# Altium schematic sheet Arduino.SchDoc
size A3; SheetNumber: 3; SheetTotal: 5
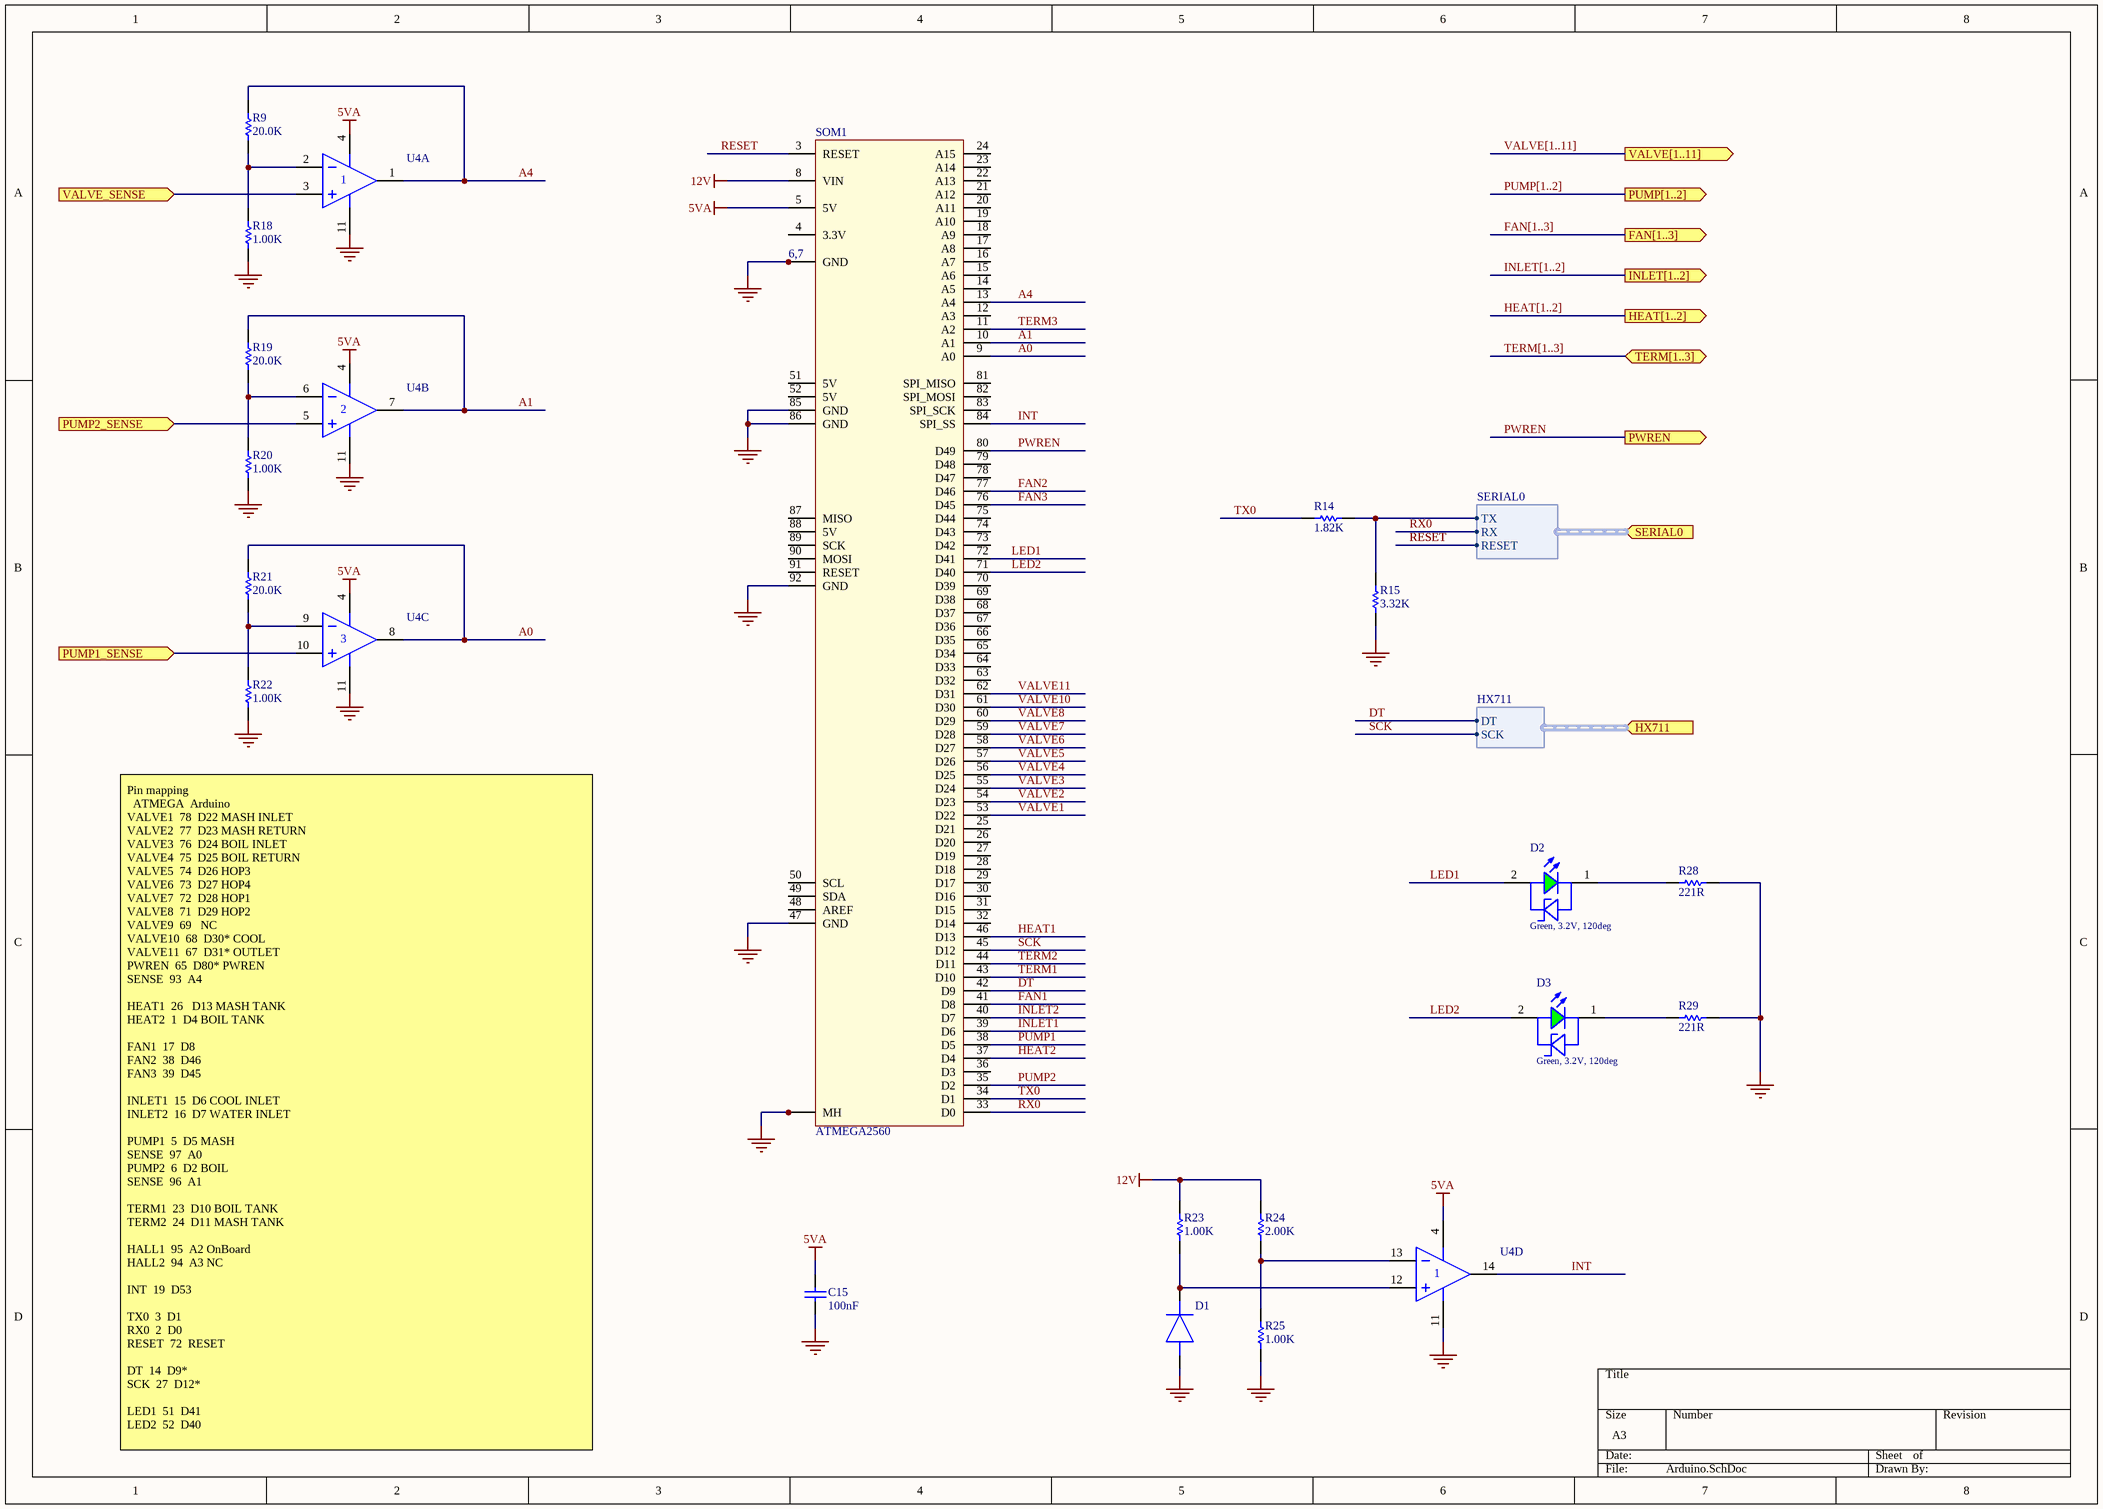
[diagram p0: Arduino.SchDoc]

## Parts
C15  value 100nF  [CAP_0603_H090 (_IPC_MD)]  (hidden comment: 100nF 0603)
D1  LL4148-GS18  [SOD-80]  (value not drawn)
D2  Green, 3.2V, 120deg  [WL-SMCC_0603_GS_BS]
D3  Green, 3.2V, 120deg  [WL-SMCC_0603_GS_BS]
R9  value 20.0K  [RES_0603_H050 (_IPC_MD)]  (hidden comment: 20.0K 1% 0,1W 75V 0603)
R14  value 1.82K  [RES_0603_H050 (_IPC_MD)]  (hidden comment: 1.82K 1% 0,1W 75V 0603)
R15  value 3.32K  [RES_0603_H050 (_IPC_MD)]  (hidden comment: 3.32K 1% 0,1W 75V 0603)
R18  value 1.00K  [RES_0603_H050 (_IPC_MD)]  (hidden comment: 1.00K 1% 0,1W 75V 0603)
R19  value 20.0K  [RES_0603_H050 (_IPC_MD)]  (hidden comment: 20.0K 1% 0,1W 75V 0603)
R20  value 1.00K  [RES_0603_H050 (_IPC_MD)]  (hidden comment: 1.00K 1% 0,1W 75V 0603)
R21  value 20.0K  [RES_0603_H050 (_IPC_MD)]  (hidden comment: 20.0K 1% 0,1W 75V 0603)
R22  value 1.00K  [RES_0603_H050 (_IPC_MD)]  (hidden comment: 1.00K 1% 0,1W 75V 0603)
R23  value 1.00K  [RES_0603_H050 (_IPC_MD)]  (hidden comment: 1.00K 1% 0,1W 75V 0603)
R24  value 2.00K  [RES_0603_H050 (_IPC_MD)]  (hidden comment: 2.00K 1% 0,1W 75V 0603)
R25  value 1.00K  [RES_0603_H050 (_IPC_MD)]  (hidden comment: 1.00K 1% 0,1W 75V 0603)
R28  value 221R  [RES_0603_H050 (_IPC_MD)]  (hidden comment: 221R 1% 0,1W 75V 0603)
R29  value 221R  [RES_0603_H050 (_IPC_MD)]  (hidden comment: 221R 1% 0,1W 75V 0603)
SOM1  ATMEGA2560  [ATMEGA2560]
U4  MAX4478ASD+  [SOIC127P600X175-14N]  (value not drawn)  (parts A,B,C,D of 4)

## Ports
FAN[1..3] (out), HEAT[1..2] (out), HX711 (in, harness HX711), INLET[1..2] (out), PUMP1_SENSE (in), PUMP2_SENSE (in), PUMP[1..2] (out), PWREN (out), SERIAL0 (in, harness SERIAL0), TERM[1..3] (bidir), VALVE[1..11] (out), VALVE_SENSE (in)

## Harnesses
SERIAL0: RESET, RX, TX
HX711: DT, SCK

## Nets
5VA: C15.1 SOM1.5(5V) U4.4(V+)
12V: R23.1 R24.1 SOM1.8(VIN)
GND: C15.2 D1.2(A) R15.2 R18.1 R20.1 R22.1 R25.2 R28.2 R29.2 SOM1.6(GND) SOM1.7(GND) SOM1.47(GND) SOM1.85(GND) SOM1.86(GND) SOM1.92(GND) SOM1.MH1(MH) SOM1.MH2(MH) SOM1.MH3(MH) SOM1.MH4(MH) SOM1.MH5(MH) U4.11(V-)
A0: R21.2 SOM1.9(A0) U4.8(OUT3)
A1: R19.2 SOM1.10(A1) U4.7(OUT2)
A4: R9.2 SOM1.13(A4) U4.1(OUT1)
DT: SOM1.42(D9) ; port HX711.DT
FAN1: SOM1.41(D8)
FAN2: SOM1.77(D46)
FAN3: SOM1.76(D45)
HEAT1: SOM1.46(D13)
HEAT2: SOM1.37(D4)
INLET1: SOM1.39(D6)
INLET2: SOM1.40(D7)
INT: SOM1.84(SPI_SS) U4.14(OUT4)
LED1: D2.2(A) SOM1.72(D41)
LED2: D3.2(A) SOM1.71(D40)
PUMP1: SOM1.38(D5)
PUMP1_SENSE: U4.10(IN3+) ; port PUMP1_SENSE
PUMP2: SOM1.35(D2)
PUMP2_SENSE: U4.5(IN2+) ; port PUMP2_SENSE
PWREN: SOM1.80(D49) ; port PWREN
RESET: SOM1.3(RESET) ; port SERIAL0.RESET
RX0: SOM1.33(D0) ; port SERIAL0.RX
SCK: SOM1.45(D12) ; port HX711.SCK
TERM1: SOM1.43(D10)
TERM2: SOM1.44(D11)
TERM3: SOM1.11(A2)
TX0: R14.1 SOM1.34(D1)
VALVE1: SOM1.53(D22)
VALVE2: SOM1.54(D23)
VALVE3: SOM1.55(D24)
VALVE4: SOM1.56(D25)
VALVE5: SOM1.57(D26)
VALVE6: SOM1.58(D27)
VALVE7: SOM1.59(D28)
VALVE8: SOM1.60(D29)
VALVE10: SOM1.61(D30)
VALVE11: SOM1.62(D31)
VALVE_SENSE: U4.3(IN1+) ; port VALVE_SENSE
NetD1_1: D1.1(K) R23.2 U4.12(IN4+)
NetD2_1: D2.1(K) R28.1
NetD3_1: D3.1(K) R29.1
NetR9_1: R9.1 R18.2 U4.2(IN1-)
NetR14_2: R14.2 R15.1 ; port SERIAL0.TX
NetR19_1: R19.1 R20.2 U4.6(IN2-)
NetR21_1: R21.1 R22.2 U4.9(IN3-)
NetR24_2: R24.2 R25.1 U4.13(IN4-)

Not connected (* = marked no-connect by the designer): SOM1 4(3.3V) 12(A3) 14(A5) 15(A6) 16(A7) 17(A8) 18(A9) 19(A10) 20(A11) 21(A12) 22(A13) 23(A14) 24(A15) 25(D21) 26(D20) 27(D19) 28(D18) 29(D17) 30(D16) 31(D15) 32(D14) 36(D3) 48(AREF) 49(SDA) 50(SCL) 51(5V) 52(5V) 63(D32) 64(D33) 65(D34) 66(D35) 67(D36) 68(D37) 69(D38) 70(D39) 73(D42) 74(D43) 75(D44) 78(D47) 79(D48) 81(SPI_MISO) 82(SPI_MOSI) 83(SPI_SCK) 87(MISO) 88(5V) 89(SCK) 90(MOSI) 91(RESET)

## Buses and harness runs
bus FAN[1..3] = port FAN[1..3]
bus HEAT[1..2] = port HEAT[1..2]
bus INLET[1..2] = port INLET[1..2]
bus PUMP[1..2] = port PUMP[1..2]
bus TERM[1..3] = port TERM[1..3]
bus VALVE[1..11] = port VALVE[1..11]

## Notes on the sheet
- Pin mapping
  ATMEGA		Arduino
  VALVE1		78		D22	MASH INLET
  VALVE2		77		D23	MASH RETURN
  VALVE3		76		D24	BOIL INLET
  VALVE4		75		D25	BOIL RETURN
  VALVE5		74		D26	HOP3
  VALVE6		73		D27	HOP4
  VALVE7		72		D28	HOP1
  VALVE8		71		D29	HOP2
  VALVE9		69			NC
  VALVE10		68		D30*	COOL
  VALVE11		67		D31*	OUTLET
  PWREN		65		D80*	PWREN
  SENSE		93		A4
  HEAT1		26 		D13	MASH TANK
  HEAT2		1		D4	BOIL TANK
  FAN1		17		D8
  FAN2		38		D46
  FAN3		39		D45
  INLET1		15		D6	COOL INLET
  INLET2		16		D7	WATER INLET
  PUMP1		5		D5	MASH
  SENSE		97		A0
  PUMP2		6		D2	BOIL
  SENSE		96		A1
  TERM1		23		D10	BOIL TANK
  TERM2		24		D11	MASH TANK
  HALL1		95		A2	OnBoard
  HALL2		94		A3	NC
  INT		19		D53
  TX0		3		D1
  RX0		2		D0
  RESET		72		RESET
  DT		14		D9*
  SCK		27		D12*
  LED1		51		D41
  LED2		52		D40
- Labels drawn without touching a wire or pin: 5VA
- (in symbol ATMEGA2560) 6,7

## Library data of the parts
C15 = CL10B104KB8NNNC: CAP CER 100NF 50V X7R 0603; Type: Standard; Designator: C?; PCB Lib: MUAB_CAP.PcbLib; Scm Lib: Discrete.SchLib; Tol: 10%; Volt: 50V; Part Number: CL10B104KB8NNNC; Dielec: X7R; Qty: 1; Supplier 1: Arrow; Supplier 2: Avnet; Supplier 3: Digi-Key; Supplier Part Number 3: 1276-1000-1-ND; Supplier 4: Distrelec; Supplier 5: Farnell; Supplier 6: Future Electronics; Supplier 7: Mouser; Supplier Part Number 7: 187-CL10B104KB8NNNC; Supplier 8: RSComponents; Supplier 9: Rutronik; Supplier 10: SEED OPL
D1 = LL4148-GS18: Diode; Manufacturer_Name: Vishay; Datasheet Link: https://www.vishay.com/docs/85557/ll4148.pdf; Manufacturer_Part_Number: LL4148-GS18; Mouser Part Number: 78-LL4148-GS18; Mouser Price/Stock: https://www.mouser.co.uk/ProductDetail/Vishay-Semiconductors/LL4148-GS18?qs=YkIJFe%252BtFEUsKqcD4T1jvg%3D%3D; Arrow Part Number: LL4148-GS18; Arrow Price/Stock: https://www.arrow.com/en/products/ll4148-gs18/vishay?region=nac
D2 D3 = 150060GS73220: WL-SMCC SMD Mono-color Chip LED Compact, size 0603, Green, 3.2V, 120deg; Dominant Wavelength: 525nm; Luminous Intensity: 700mcd; Peak Wavelength: 520nm; Chip Technology: InGaN; ComponentLink1URL: http://www.we-online.de; ComponentLink2Description: Datasheet; ComponentLink2URL: https://katalog.we-online.com/led/datasheet/150060GS73220.pdf; Part Number: 150060GS73220; Published Date: July 2019; Publisher: Wurth Elektronik; Size: 0603; Viewing Angle: 120deg; Packaging: Tape and Reel; Emitting Color: Green; Mounting Technology: SMT; Forward Voltage: 3.2V; Operating Temperature: -40 to +85degC
R9 R19 R21 = RES20.0K1%0603: Designator: R; PCB Lib: MUAB_RES.PcbLib; Scm Lib: Discrete.SchLib; Watt: 0,1W; Tol: 1%; Part Number: RES20.0K1%0603; Type: Standard; Volt: 75V; Qty: 1; Supplier 1: Arrow; Supplier 2: Avnet; Supplier 3: Digi-Key; Supplier 4: Distrelec; Supplier 5: Farnell; Supplier 6: Future Electronics; Supplier 7: Mouser; Supplier 8: RSComponents; Supplier 9: Rutronik; Supplier 10: SEED OPL
R14 = RES1.82K1%0603: Designator: R; PCB Lib: MUAB_RES.PcbLib; Scm Lib: Discrete.SchLib; Watt: 0,1W; Tol: 1%; Part Number: RES1.82K1%0603; Type: Standard; Volt: 75V; Qty: 1; Supplier 1: Arrow; Supplier 2: Avnet; Supplier 3: Digi-Key; Supplier 4: Distrelec; Supplier 5: Farnell; Supplier 6: Future Electronics; Supplier 7: Mouser; Supplier 8: RSComponents; Supplier 9: Rutronik; Supplier 10: SEED OPL
R15 = RES3.32K1%0603: Designator: R; PCB Lib: MUAB_RES.PcbLib; Scm Lib: Discrete.SchLib; Watt: 0,1W; Tol: 1%; Part Number: RES3.32K1%0603; Type: Standard; Volt: 75V; Qty: 1; Supplier 1: Arrow; Supplier 2: Avnet; Supplier 3: Digi-Key; Supplier 4: Distrelec; Supplier 5: Farnell; Supplier 6: Future Electronics; Supplier 7: Mouser; Supplier 8: RSComponents; Supplier 9: Rutronik; Supplier 10: SEED OPL
R18 R20 R22 R23 R25 = RES1.00K1%0603: Designator: R; PCB Lib: MUAB_RES.PcbLib; Scm Lib: Discrete.SchLib; Watt: 0,1W; Tol: 1%; Part Number: RES1.00K1%0603; Type: Standard; Volt: 75V; Qty: 1; Supplier 1: Arrow; Supplier 2: Avnet; Supplier 3: Digi-Key; Supplier 4: Distrelec; Supplier 5: Farnell; Supplier 6: Future Electronics; Supplier 7: Mouser; Supplier 8: RSComponents; Supplier 9: Rutronik; Supplier 10: SEED OPL
R24 = RES2.00K1%0603: Designator: R; PCB Lib: MUAB_RES.PcbLib; Scm Lib: Discrete.SchLib; Watt: 0,1W; Tol: 1%; Part Number: RES2.00K1%0603; Type: Standard; Volt: 75V; Qty: 1; Supplier 1: Arrow; Supplier 2: Avnet; Supplier 3: Digi-Key; Supplier 4: Distrelec; Supplier 5: Farnell; Supplier 6: Future Electronics; Supplier 7: Mouser; Supplier 8: RSComponents; Supplier 9: Rutronik; Supplier 10: SEED OPL
R28 R29 = RES221R1%0603: Designator: R; PCB Lib: MUAB_RES.PcbLib; Scm Lib: Discrete.SchLib; Watt: 0,1W; Tol: 1%; Part Number: RES221R1%0603; Type: Standard; Volt: 75V; Qty: 1; Supplier 1: Arrow; Supplier 2: Avnet; Supplier 3: Digi-Key; Supplier 4: Distrelec; Supplier 5: Farnell; Supplier 6: Future Electronics; Supplier 7: Mouser; Supplier 8: RSComponents; Supplier 9: Rutronik; Supplier 10: SEED OPL
U4 = MAX4478ASD+: IC OPAMP GP 2 CIRCUIT 8SOIC; Designator: U?; PCB Lib: MUAB_SO.PcbLib; Scm Lib: Maxim.SchLib; Value: 1; Volt: 2.7V ~ 5.5V; Watt: 48mA; Part Number: MAX4478ASD+; Type: Standard; Qty: 1; Supplier 1: Arrow; Supplier 2: Avnet; Supplier 3: Digi-Key; Supplier Part Number 3: MAX4478ASD+TTR-ND; Supplier 4: Distrelec; Supplier 5: Farnell; Supplier 6: Future Electronics; Supplier 7: Mouser; Supplier Part Number 7: 700-MAX4478ASDT; Supplier 8: RSComponents; Supplier 9: Rutronik; Supplier 10: SEED OPL
SOM1 = ATMEGA2560: Arduino: ATMega 2560